# EAGLE design crossingsignals (EAGLE 9.6.2)
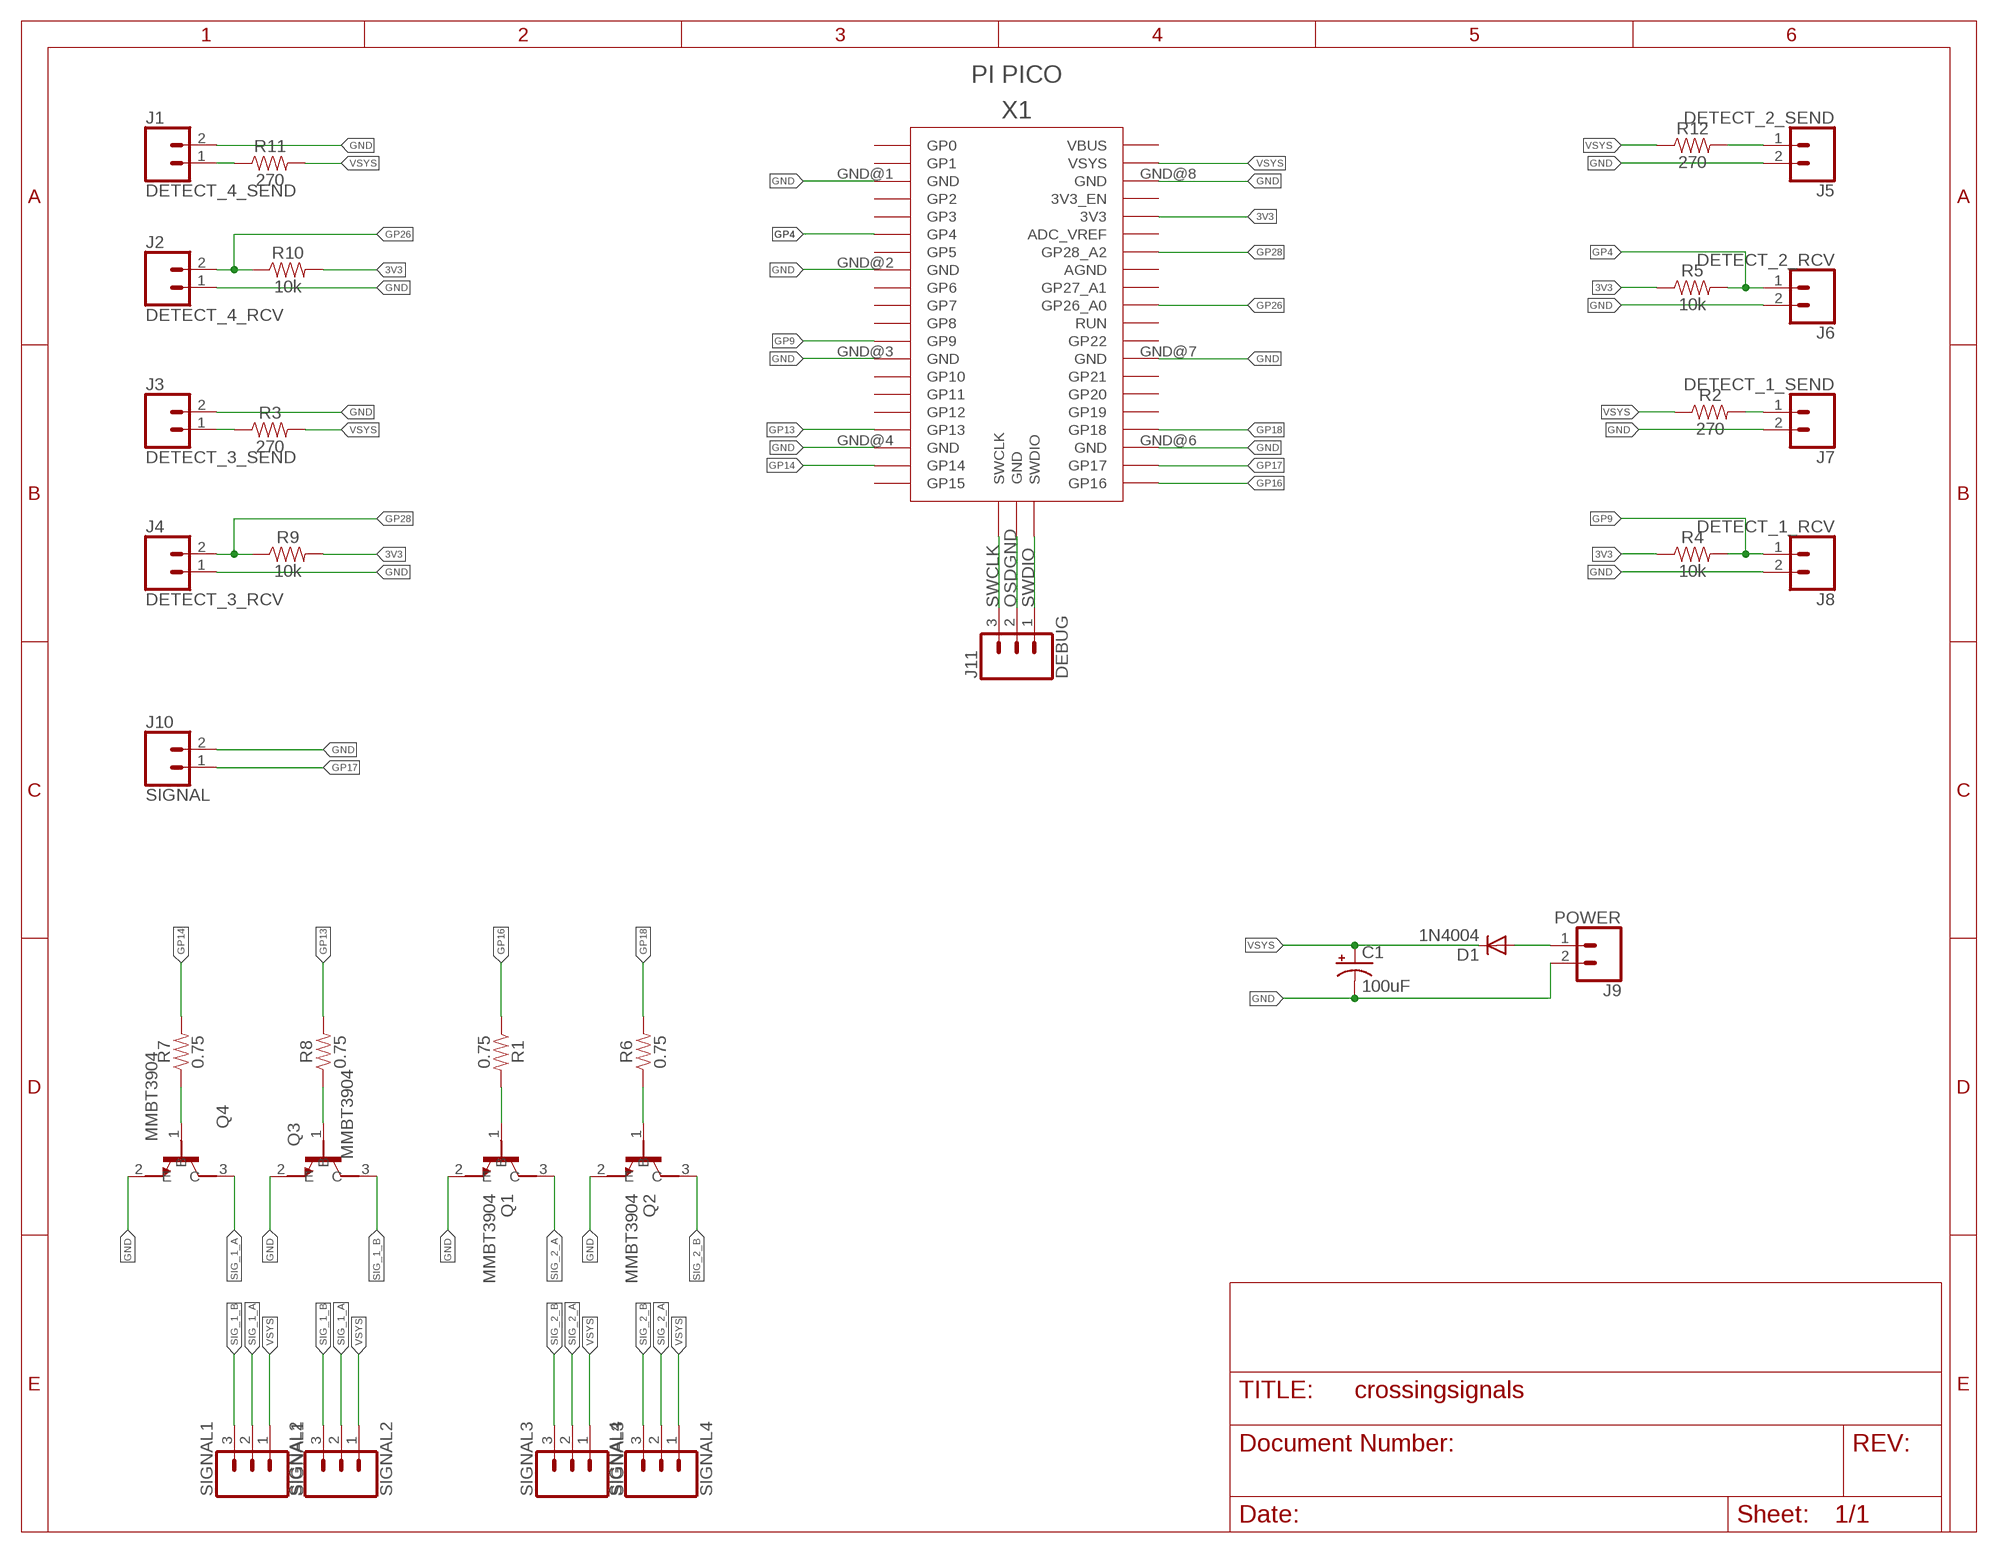
[diagram p0: schematic, sheet 1]

## Parts
C1  100uF  100UF-POLAR-RADIAL-2.5MM-25V-20%  [CPOL-RADIAL-2.5MM-6.5MM]
D1  1N4004  [DO41-10]
J1  DETECT_4_SEND  CONN_02  [1X02]
J2  DETECT_4_RCV  CONN_02  [1X02]
J3  DETECT_3_SEND  CONN_02  [1X02]
J4  DETECT_3_RCV  CONN_02  [1X02]
J5  DETECT_2_SEND  CONN_02  [1X02]
J6  DETECT_2_RCV  CONN_02  [1X02]
J7  DETECT_1_SEND  CONN_02  [1X02]
J8  DETECT_1_RCV  CONN_02  [1X02]
J9  POWER  CONN_02  [1X02]
J10  SIGNAL  CONN_02  [1X02]
J11  DEBUG  CONN_03  [1X03]
Q1  MMBT3904  [SOT95P240X120-3N]
Q2  MMBT3904  [SOT95P240X120-3N]
Q3  MMBT3904  [SOT95P240X120-3N]
Q4  MMBT3904  [SOT95P240X120-3N]
R1  0.75  0.75OHM-0805-1/4W-1%  [0805]
R2  270  0.75OHM-0805-1/4W-1%  [0805]
R3  270  0.75OHM-0805-1/4W-1%  [0805]
R4  10k  0.75OHM-0805-1/4W-1%  [0805]
R5  10k  0.75OHM-0805-1/4W-1%  [0805]
R6  0.75  0.75OHM-0805-1/4W-1%  [0805]
R7  0.75  0.75OHM-0805-1/4W-1%  [0805]
R8  0.75  0.75OHM-0805-1/4W-1%  [0805]
R9  10k  0.75OHM-0805-1/4W-1%  [0805]
R10  10k  0.75OHM-0805-1/4W-1%  [0805]
R11  270  0.75OHM-0805-1/4W-1%  [0805]
R12  270  0.75OHM-0805-1/4W-1%  [0805]
SIGNAL1  SIGNAL1  CONN_03  [1X03]
SIGNAL2  SIGNAL2  CONN_03  [1X03]
SIGNAL3  SIGNAL3  CONN_03  [1X03]
SIGNAL4  SIGNAL4  CONN_03  [1X03]
X1  PI PICO  RPI_PICO_IG-TH  [RPI_PICO_TH]

## Nets
3V3: R4.1 R5.1 R9.2 R10.2 X1.3V3
GND: C1.2(-) J1.2 J2.1 J3.2 J4.1 J5.2 J6.2 J7.2 J8.2 J9.2 J10.2 Q1.2(E) Q2.2(E) Q3.2(E) Q4.2(E) X1.GND@1(GND) X1.GND@2(GND) X1.GND@3(GND) X1.GND@4(GND) X1.GND@6(GND) X1.GND@7(GND) X1.GND@8(GND)
GP4: J6.1 R5.2 X1.GP4
GP9: J8.1 R4.2 X1.GP9
GP13: R8.2 X1.GP13
GP14: R7.2 X1.GP14
GP16: R1.1 X1.GP16
GP17: J10.1 X1.GP17
GP18: R6.2 X1.GP18
GP26: J2.2 R10.1 X1.GP26_A0
GP28: J4.2 R9.1 X1.GP28_A2
N$1: Q4.1(B) R7.1
N$2: Q3.1(B) R8.1
N$3: Q2.1(B) R6.1
N$5: D1.A J9.1
N$9: J3.1 R3.1
N$10: J1.1 R11.1
N$12: Q1.1(B) R1.2
N$15: J5.1 R12.2
N$20: J7.1 R2.2
OSDGND: J11.2 X1.GND@5(GND)
SIG_1_A: Q4.3(C) SIGNAL1.2 SIGNAL2.2
SIG_1_B: Q3.3(C) SIGNAL1.3 SIGNAL2.3
SIG_2_A: Q1.3(C) SIGNAL3.2 SIGNAL4.2
SIG_2_B: Q2.3(C) SIGNAL3.3 SIGNAL4.3
SWCLK: J11.3 X1.SWCLK
SWDIO: J11.1 X1.SWDIO
VSYS: C1.1(+) D1.C R2.1 R3.2 R11.2 R12.1 SIGNAL1.1 SIGNAL2.1 SIGNAL3.1 SIGNAL4.1 X1.VSYS
Unconnected: X1.3V3_EN X1.ADC_VREF X1.AGND X1.GP0 X1.GP1 X1.GP2 X1.GP3 X1.GP5 X1.GP6 X1.GP7 X1.GP8 X1.GP10 X1.GP11 X1.GP12 X1.GP15 X1.GP19 X1.GP20 X1.GP21 X1.GP22 X1.GP27_A1 X1.RUN X1.VBUS

## Library data of the parts
C1 = SparkFun-Capacitors:100UF-POLAR: 100µF polarized capacitors A capacitor is a passive two-terminal electrical component used to store electrical energy temporarily in an electric field.; PROD_ID: CAP-08439
D1 = adafruit:1N4004: DIODE General purpose 1N400x type rectifier (With bigger pads) http://www.ladyada.net/library/pcb/eaglelibrary.html
J1-J10 = SparkFun-Connectors:CONN_02: Multi connection point. Often used as Generic Header-pin footprint for 0.1 inch spaced/style header connections On any of the 0.1 inch spaced packages, you can populate with these: Break Away Headers - Straight <https://www.sparkfun.com/products/116> (PRT-00116) Break Away Male Headers - Right Angle <https://www.sparkfun.com/products/553> (PRT-00553) Female Headers <https://www.sparkfun.com/products/115> (PRT-00115) Break Away Headers - Machine Pin <https://www.sparkfun.com/products/117> (PRT-00117) Break Away Female Headers - Swiss Machine Pin <https://www.sparkfun.com/products/743> (PRT-00743) For SCREWTERMINALS and SPRING TERMINALS visit here: Screw Terimnals on SparkFun.com <https://www.sparkfun.com/search/results?term=Screw+Terminals> (5mm/3.5mm/2.54mm spacing) This device is also useful as a general connection point to wire up your design to another part of your project. Our various solder wires solder well into these plated through hole pads. Hook-Up Wire - Assortment (Stranded, 22 AWG) <https://www.sparkfun.com/products/11375> (PRT-11375) Hook-Up Wire - Assortment (Solid Core, 22 AWG) <https://www.sparkfun.com/products/11367> (PRT-11367) View the entire wire category on our website here <https://www.sparkfun.com/categories/141> Special notes: Molex polarized connector foot print use with: PRT-08233 with associated crimp pins and housings. 2.54_SCREWTERM for use with PRT-10571. 3.5mm Screw Terminal footprints for PRT-08084 5mm Screw Terminal footprints for use with PRT-08432
J11 SIGNAL1-SIGNAL4 = SparkFun-Connectors:CONN_03: Multi connection point. Often used as Generic Header-pin footprint for 0.1 inch spaced/style header connections On any of the 0.1 inch spaced packages, you can populate with these: Break Away Headers - Straight <https://www.sparkfun.com/products/116> (PRT-00116) Break Away Male Headers - Right Angle <https://www.sparkfun.com/products/553> (PRT-00553) Female Headers <https://www.sparkfun.com/products/115> (PRT-00115) Break Away Headers - Machine Pin <https://www.sparkfun.com/products/117> (PRT-00117) Break Away Female Headers - Swiss Machine Pin <https://www.sparkfun.com/products/743> (PRT-00743) Stackable Header - 3 Pin (Female, 0.1") <https://www.sparkfun.com/products/13875> (PRT-13875) For SCREWTERMINALS and SPRING TERMINALS visit here: Screw Terimnals on SparkFun.com <https://www.sparkfun.com/search/results?term=Screw+Terminals> (5mm/3.5mm/2.54mm spacing) This device is also useful as a general connection point to wire up your design to another part of your project. Our various solder wires solder well into these plated through hole pads. Hook-Up Wire - Assortment (Stranded, 22 AWG) <https://www.sparkfun.com/products/11375> (PRT-11375) Hook-Up Wire - Assortment (Solid Core, 22 AWG) <https://www.sparkfun.com/products/11367> (PRT-11367) View the entire wire category on our website here <https://www.sparkfun.com/categories/141> Special notes: Molex polarized connector foot print use with SKU : PRT-08232 with associated crimp pins and housings.
Q1-Q4 = MMBT3904:MMBT3904: MMBT3904 Series 40 V CE Breakdown 0.2 A NPN General Purpose Amplifier - SOT-23 Check prices <https://pricing.snapeda.com/parts/MMBT3904/STMicroelectronics/view-part?ref=eda>; AVAILABILITY: Bad; DESCRIPTION: Bipolar (BJT) Transistor NPN 40V 200mA 300MHz 300mW Surface Mount SOT-23-3; MF: STMicroelectronics; MP: MMBT3904; PACKAGE: SOT-23-3 Taiwan Semiconductor; PRICE: None
R1 R6-R8 = SparkFun-Resistors:0.75OHM: 0.75Ω resistor A resistor is a passive two-terminal electrical component that implements electrical resistance as a circuit element. Resistors act to reduce current flow, and, at the same time, act to lower voltage levels within circuits. - Wikipedia; PROD_ID: RES-08474
R2-R5 R9-R12 = SparkFun-Resistors:0.75OHM: 0.75Ω resistor A resistor is a passive two-terminal electrical component that implements electrical resistance as a circuit element. Resistors act to reduce current flow, and, at the same time, act to lower voltage levels within circuits. - Wikipedia; PROD_ID: RES-08474; VALUE: 0.75
X1 = RaspberryPi_Pico:RPI_PICO_IG

## Board
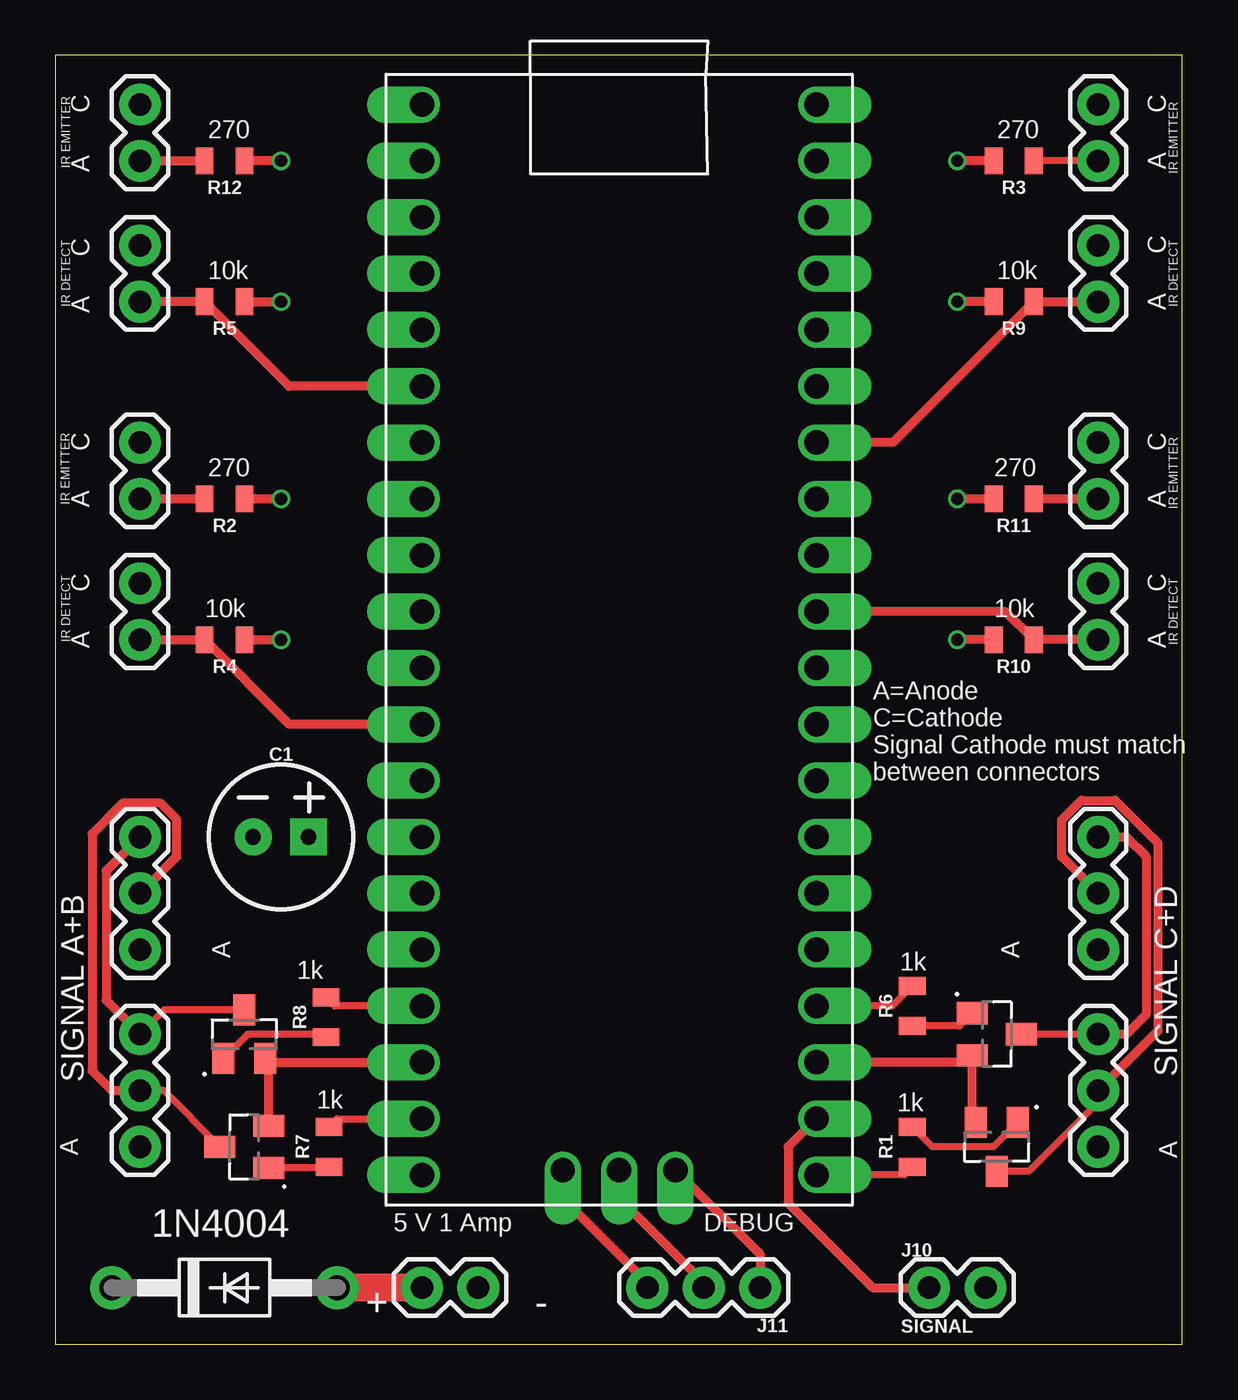
[diagram p1: board, top side]
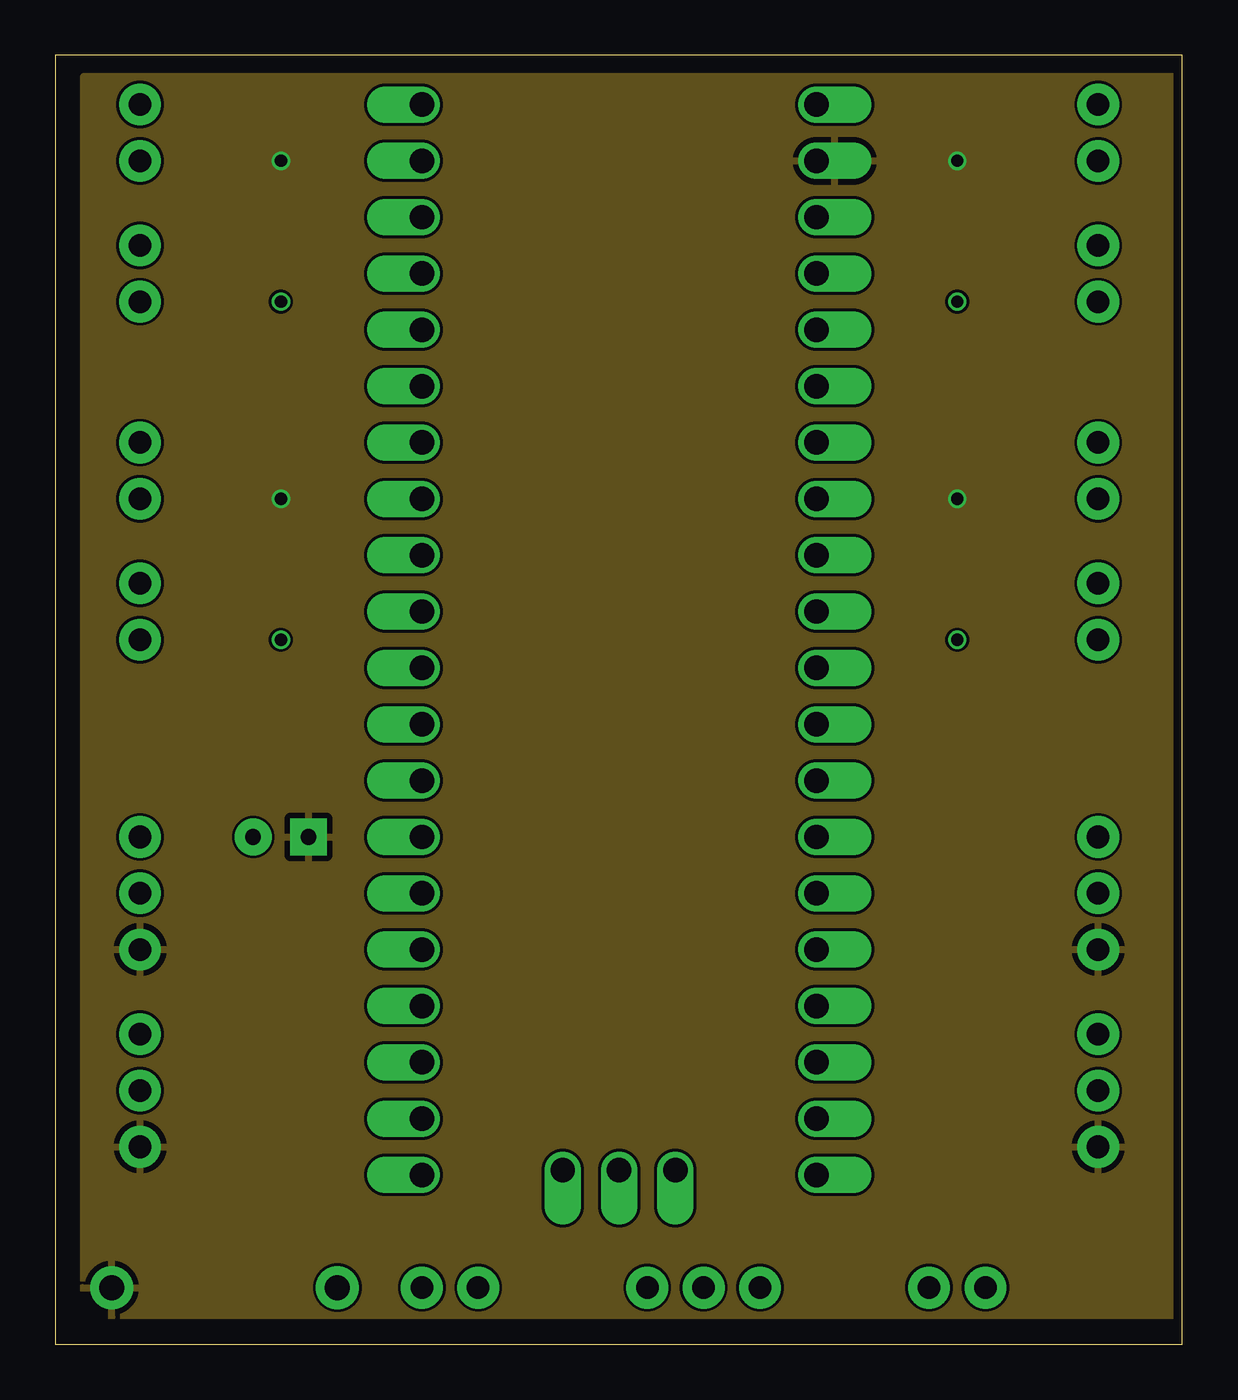
[diagram p2: board, inner layer Route2]
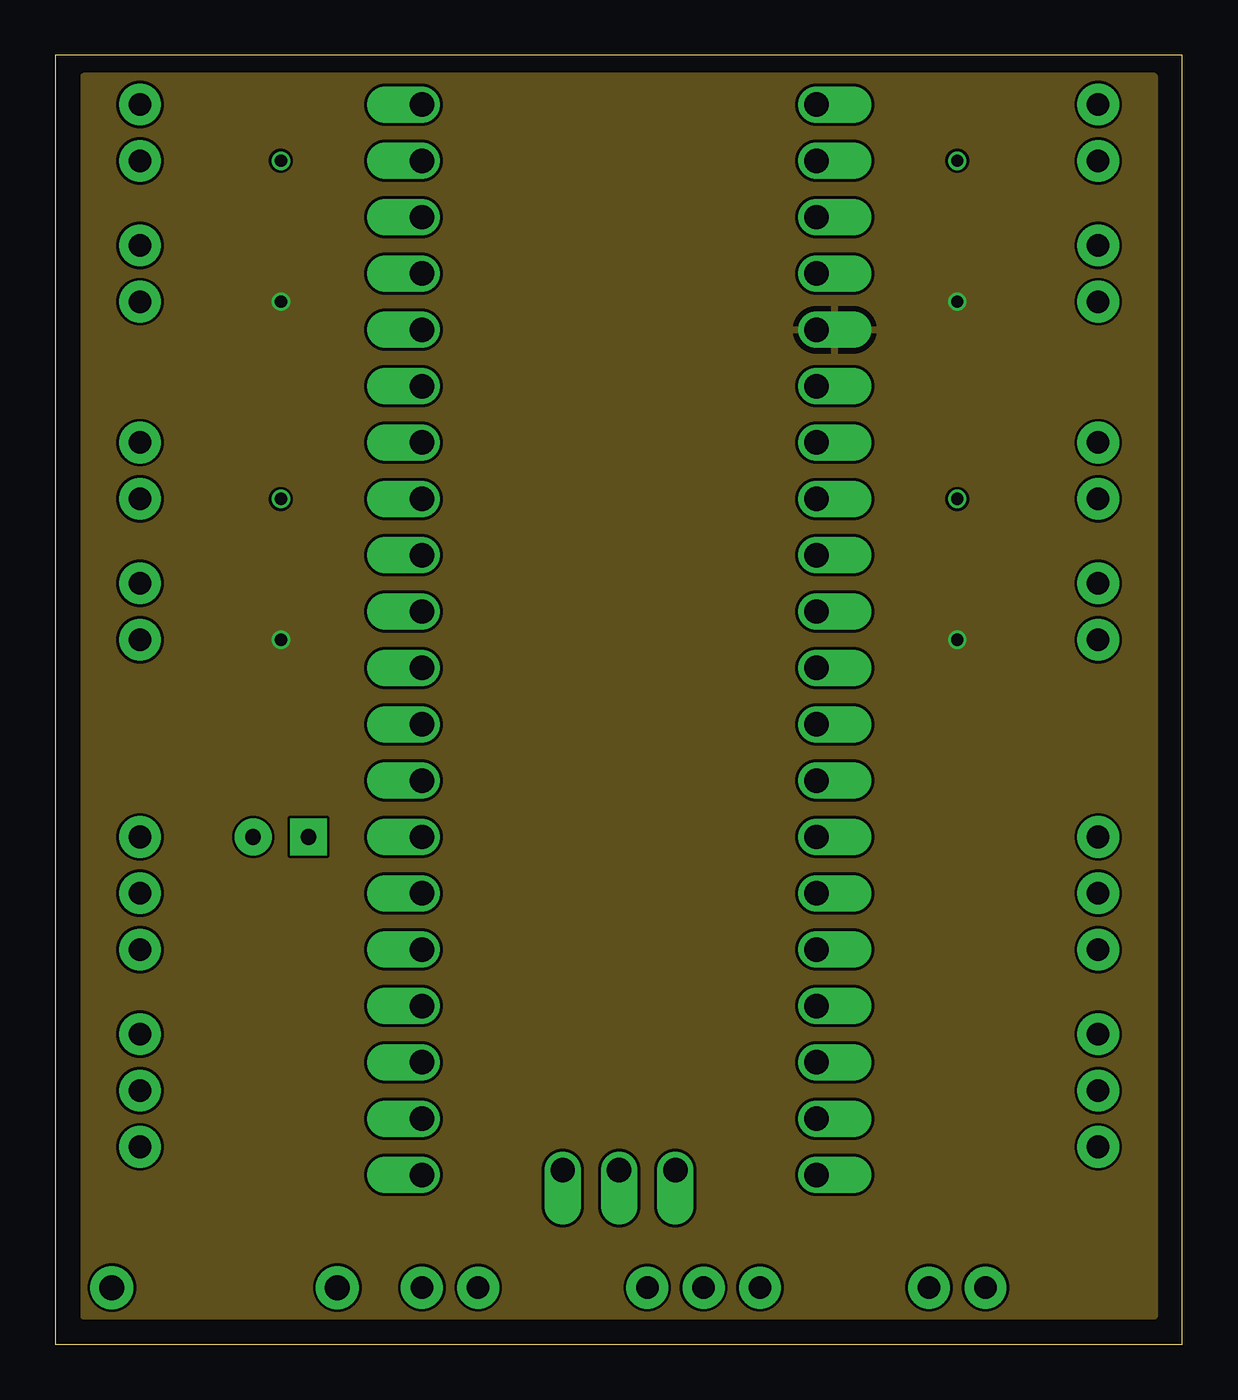
[diagram p3: board, inner layer Route15]
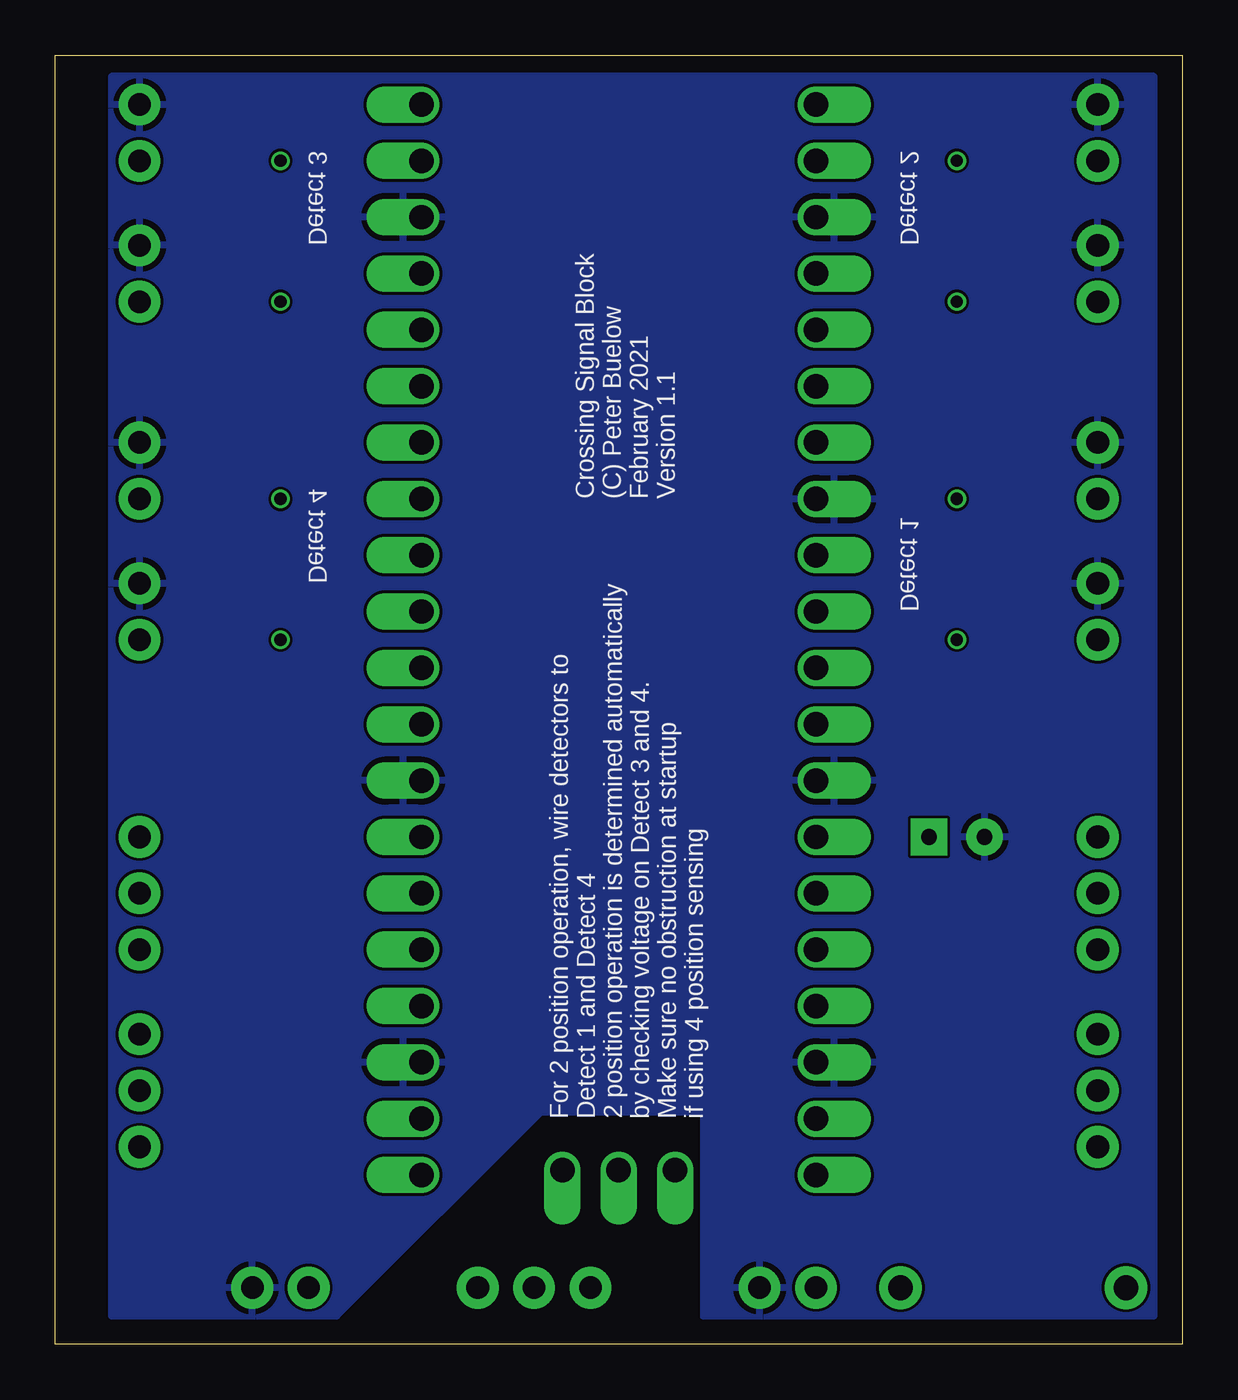
[diagram p4: board, bottom side, seen from below]

Size 50.78 x 58.09 mm. Coordinates in mm from the lower left corner, seen from the top.
Outline: 0,0 50.78,0 50.78,58.09 0,58.09 0,0
Copper layers (1*2*15*16): Top 0.035559375mm / dielectric 0.17018125mm / Route2 0.01778125mm / dielectric 47mil / Route15 0.01778125mm / dielectric 0.17018125mm / Bottom 0.035559375mm
Design rules "oshpark-4layer": minimum track width 5mil, minimum drill 10mil, track to track 5mil, track to pad 5mil, pad to pad 5mil, via to via 5mil, smd to smd 5mil, copper to edge 15mil, drill to drill 6mil, minimum pad ring 4mil, minimum via ring 4mil, stop-mask expansion 1.5mil, vias tented up to drill 0mil, thermal gap 10mil

### Footprints (pad centres in the part's own frame; a part is rotated, then mirrored left to right if it is on the bottom)
CPOL-RADIAL-2.5MM-6.5MM = drill 0.7 pad 1.651 square: 1 1.25,0 | drill 0.7 pad 1.651: 2 -1.25,0
DO41-10 = drill 1.118 pad 1.93: A 5.08,0; C -5.08,0
1X02 = drill 1.016 pad 1.88: 1 0,0; 2 2.54,0
1X03 = drill 1.016 pad 1.88: 1 0,0; 2 2.54,0; 3 5.08,0
SOT95P240X120-3N = smd 1 x 1.4: 1 -0.95,-1.1; 2 0.95,-1.1; 3 0,1.1
0805 = smd 0.8 x 1.2: 1 -0.9,0; 2 0.9,0
RPI_PICO_TH = drill 1.1 pad 1.6 offset: 3V3 8.89,13.97; 3V3_EN 8.89,16.51; ADC_VREF 8.89,11.43; AGND 8.89,6.35; GND@1 -8.89,19.05; GND@2 -8.89,6.35; GND@3 -8.89,-6.35; GND@4 -8.89,-19.05; GND@5 0,-23.9; GND@6 8.89,-19.05; GND@7 8.89,-6.35; GND@8 8.89,19.05; GP0 -8.89,24.13; GP1 -8.89,21.59; GP2 -8.89,16.51; GP3 -8.89,13.97; GP4 -8.89,11.43; GP5 -8.89,8.89; GP6 -8.89,3.81; GP7 -8.89,1.27; GP8 -8.89,-1.27; GP9 -8.89,-3.81; GP10 -8.89,-8.89; GP11 -8.89,-11.43; GP12 -8.89,-13.97; GP13 -8.89,-16.51; GP14 -8.89,-21.59; GP15 -8.89,-24.13; GP16 8.89,-24.13; GP17 8.89,-21.59; GP18 8.89,-16.51; GP19 8.89,-13.97; GP20 8.89,-11.43; GP21 8.89,-8.89; GP22 8.89,-3.81; GP26_A0 8.89,1.27; GP27_A1 8.89,3.81; GP28_A2 8.89,8.89; RUN 8.89,-1.27; SWCLK -2.54,-23.9; SWDIO 2.54,-23.9; VBUS 8.89,24.13; VSYS 8.89,21.59

### Placement (x,y rotation side)
C1  10.16,22.86 0 top
D1  7.62,2.54 0 top
J1  46.99,38.1 90 top
J2  46.99,34.29 270 top
J3  46.99,53.34 90 top
J4  46.99,49.53 270 top
J5  3.81,53.34 90 top
J6  3.81,46.99 90 top
J7  3.81,38.1 90 top
J8  3.81,31.75 90 top
J9  16.51,2.54 0 top
J10  39.37,2.54 0 top
J11  31.75,2.54 180 top
Q1  42.42,8.89 180 top
Q2  42.42,13.97 270 top
Q3  8.51,13.97 0 top
Q4  8.51,8.89 90 top
R1  38.61,8.89 90 top
R2  7.62,38.1 180 top
R3  43.18,53.34 180 top
R4  7.62,31.75 180 top
R5  7.62,46.99 180 top
R6  38.61,15.24 90 top
R7  12.32,8.89 90 top
R8  12.19,14.73 90 top
R9  43.18,46.99 180 top
R10  43.18,31.75 180 top
R11  43.18,38.1 180 top
R12  7.62,53.34 180 top
SIGNAL1  3.81,8.89 90 top
SIGNAL2  3.81,17.78 90 top
SIGNAL3  46.99,8.89 90 top
SIGNAL4  46.99,17.78 90 top
X1  25.4,31.75 0 top

### Tracks (layer width: path | path; a pad name or v marks a point on that pad's centre or on a via)
3V3  (via drill 0.55)
  Top 0.406: R4.1 v10.16,31.75 | R5.1 v10.16,46.99 | R9.2 v40.64,46.99 | R10.2 v40.64,31.75
  pour Route15: 1.27,57.15 1.27,1.27 49.53,1.27 49.53,57.15
GND
  Top 0.406: Q1.2 41.32,10.14 Q2.2 41,12.7 X1.GND@6 | Q4.2 9.61,12.72 Q3.2 9.63,12.7 X1.GND@4
  pour Bottom: 1.27,57.15 48.26,57.15 48.26,1.27 38.1,1.27 28.89,10.48 21.59,10.48 21.59,1.27 1.27,1.27
GP4
  Top 0.406: J6.1 R5.2 10.53,43.18 X1.GP4
GP9
  Top 0.406: J8.1 R4.2 10.53,27.94 X1.GP9
GP13
  Top 0.305: X1.GP13 12.58,15.24 R8.2
GP14
  Top 0.305: R7.2 12.69,10.16 X1.GP14
GP16
  Top 0.305: R1.1 38.24,7.62 X1.GP16
GP17
  Top 0.406: X1.GP17 33.02,8.89 33.02,6.35 36.83,2.54 J10.1
GP18
  Top 0.305: R6.2 37.71,15.24 X1.GP18
GP26
  Top 0.406: J2.2 R10.1 42.81,33.02 X1.GP26_A0
GP28
  Top 0.406: J4.2 R9.1 37.73,40.64 X1.GP28_A2
N$1
  Top 0.305: R7.1 12.27,7.94 Q4.1
N$2
  Top 0.305: Q3.1 8.66,13.97 12.07,13.95 R8.1
N$3
  Top 0.305: Q2.1 40.74,14.34 R6.1
N$5
  Top 1.27: J9.1 D1.A
N$9
  Top 0.305: J3.1 R3.1
N$10
  Top 0.406: J1.1 R11.1
N$12
  Top 0.305: Q1.1 42.27,8.89 39.51,8.89 R1.2
N$15
  Top 0.406: J5.1 R12.2
N$20
  Top 0.406: R2.2 J7.1
OSDGND
  Top 0.406: X1.GND@5 25.4,6.58 29.21,2.77 J11.2
SIG_1_A
  Top 0.305: Q4.3 4.87,11.43 SIGNAL1.2
  Top 0.406: SIGNAL2.2 5.46,21.97 5.46,23.64 4.72,24.38 3.03,24.38 1.65,23 1.65,12.32 2.54,11.43 SIGNAL1.2
SIG_1_B
  Top 0.305: Q3.3 4.91,15.07 SIGNAL1.3
  Top 0.406: SIGNAL2.3 2.29,21.34 2.29,15.49 SIGNAL1.3
SIG_2_A
  Top 0.305: SIGNAL3.2 46.99,10.92 43.86,7.79 Q1.3
  Top 0.406: SIGNAL4.2 45.34,21.97 45.34,23.62 46.23,24.51 47.75,24.51 49.68,22.58 49.68,14.12 SIGNAL3.2
SIG_2_B
  Top 0.305: SIGNAL3.3 Q2.3
  Top 0.406: SIGNAL4.3 48.26,22.86 49.15,21.97 49.15,14.86 48.26,13.97 SIGNAL3.3
SWCLK
  Top 0.406: X1.SWCLK 22.86,6.58 26.67,2.77 J11.3
SWDIO
  Top 0.406: X1.SWDIO 31.75,4.04 J11.1
VSYS  (via drill 0.55)
  Top 0.406: v10.16,53.34 R12.1 | v10.16,38.1 R2.1 | R3.2 v40.64,53.34 | R11.2 v40.64,38.1
  pour Route2: 1.27,57.15 52.07,57.15 52.07,1.27 1.27,1.27

### Text on the board
_tsilk: IR EMITTER | IR EMITTER | C | C | 270 | 270 | A | A | IR DETECT | IR DETECT | C | C | 10k | 10k | A | A | IR EMITTER | C | C | 270 | 270 | IR EMITTER | A | A | IR DETECT | IR DETECT | C | C | 10k | 10k | A | A | A=Anode / C=Cathode / Signal Cathode must match / between connectors | 1k | A | 1k | A | SIGNAL A+B | SIGNAL C+D | 1k | 1k | A | A | 5 V 1 Amp | DEBUG | + | -
_bsilk: Detect 2 | Detect 3 | Crossing Signal Block / (C) Peter Buelow / February 2021 / Version 1.1 | Detect 4 | Detect 1 | For 2 position operation, wire detectors to / Detect 1 and Detect 4 / 2 position operation is determined automatically / by checking voltage on Detect 3 and 4. / Make sure no obstruction at startup / if using 4 position sensing